# Altium project LM-004-B.PrjPcb
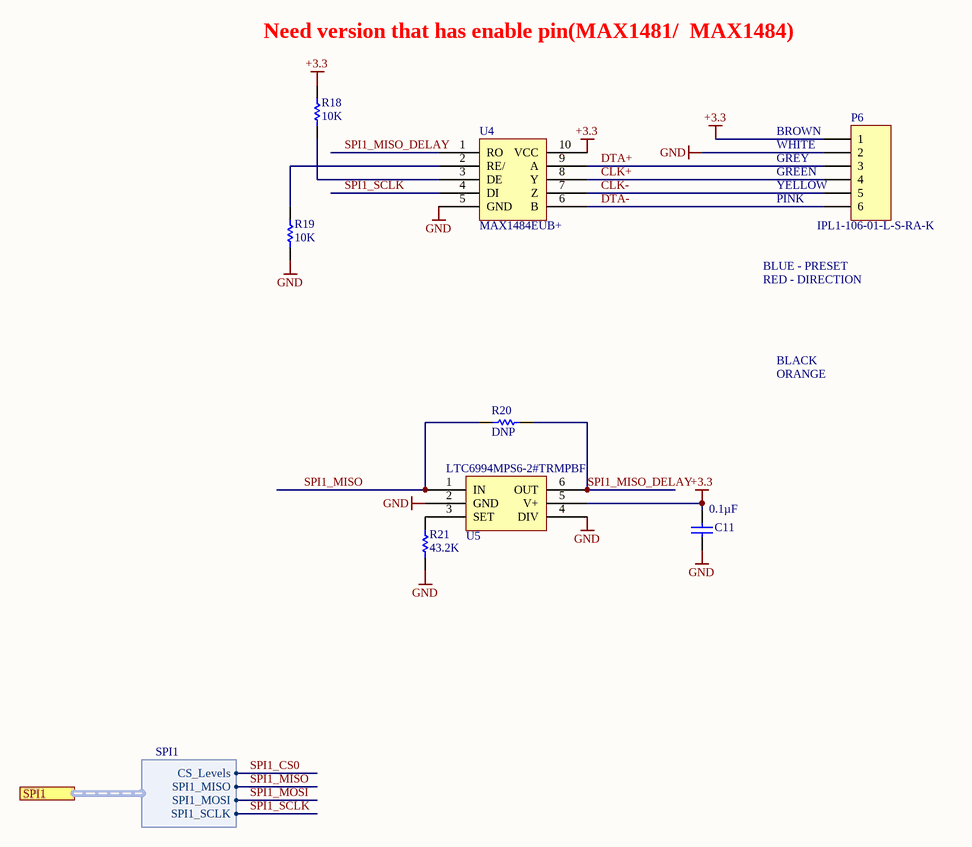
[diagram p0: Encoder.SchDoc]
1 sheet, 8 parts. Net scope: flat (ports and power ports of the same name join across sheets).
Board file: LM-004-B.PcbDoc

## Sheet Encoder.SchDoc: Encoder
size OrCAD A; DocumentNumber: LM-004; Revision: B; SheetNumber: 2; SheetTotal: 4

### Parts
C11  Capacitance: 0.1µF  [CAPC0805(2012)145_N]  (hidden comment: CAP CER 0.1UF 25V X7R 0805)
P6  IPL1-106-01-L-S-RA-K  [IPL1-106-01-L-S-RA-K]
R18  10K  [RESC0805(2012)_L]
R19  10K  [RESC0805(2012)_L]
R20  DNP  [RESC0805(2012)_L]
R21  43.2K  [RESC0805(2012)_L]
U4  MAX1484EUB+  [MAX1484EUB+]
U5  LTC6994MPS6-2#TRMPBF  [LTC6994MPS6-2#TRMPBF]

### Ports
SPI1 (harness SPI1)

### Harnesses
SPI1: CS_Levels, SPI1_MISO, SPI1_MOSI, SPI1_SCLK

### Nets
+3.3: C11.1 P6.1 R18.2 U4.10(VCC) U5.5(V+)
GND: C11.2 P6.2 R19.1 R21.2 U4.5(GND) U5.2(GND) U5.4(DIV)
CLK+: P6.4 U4.8(Y)
CLK-: P6.5 U4.7(Z)
DTA+: P6.3 U4.9(A)
DTA-: P6.6 U4.6(B)
SPI1_CS0: port SPI1.CS_Levels
SPI1_MISO: R20.1 U5.1(IN) ; port SPI1.SPI1_MISO
SPI1_MISO_DELAY: R20.2 U4.1(RO) U5.6(OUT)
SPI1_MOSI: port SPI1.SPI1_MOSI
SPI1_SCLK: U4.4(DI) ; port SPI1.SPI1_SCLK
NetR18_1: R18.1 U4.3(DE)
NetR19_2: R19.2 U4.2(RE/)
NetR21_1: R21.1 U5.3(SET)

### Notes on the sheet
- Need version that has enable pin(MAX1481/  MAX1484)
- (near P6) BROWN
- (near P6) WHITE
- (near P6) GREY
- (near P6) GREEN
- (near P6) YELLOW
- (near P6) PINK
- BLUE - PRESET
- RED - DIRECTION
- ORANGE
- BLACK
- Title
- Size:
- Date:
- Orcad A
- Number:
- Time:
- Revision:
- Sheet
- of
- ZLS Corporation
- 7801 North Lamar Blvd.
- Suite E-184
- Austin, Texas 78752  USA
- (512) 453-0288
- File:

### Library data of the parts
C11 = CMP-1036-04795-1: Manufacturer: Murata Electronics North America; Manufacturer Part Number: GRM21BR71E104KA01L; Tolerance: ±10%; Supplier 1: Digi-Key; Supplier Part Number 1: 490-1673-6-ND; RoHS: RoHS Compliant; Category: Capacitors; Stock 1: 891652; Pricing 1: 1=0.2, 10=0.145, 100=0.0683, 500=0.04788, 1000=0.03964 (USD); Packaging: Digi-Reel®; Part Status: Active; Voltage - Rated: 25V; Temperature Coefficient: X7R; Operating Temperature: -55°C ~ 125°C; Features: -; Ratings: -; Applications: General Purpose; Mounting Type: Surface Mount, MLCC; Package / Case: 0805 (2012 Metric); Size / Dimension: 0.079" L x 0.049" W (2.00mm x 1.25mm); Height - Seated (Max): -; Thickness (Max): 0.053" (1.35mm); Lead Spacing: -; Lead Style: -; ComponentLink1URL: http://www.murata.com/~/media/webrenewal/support/library/catalog/products/capacitor/mlcc/c02e.ashx; ComponentLink1Description: http://www.murata.com/~/media/webrenewal/support/library/catalog/products/capacitor/mlcc/c02e.ashx
P6 = Header 6: Header, 6-Pin; Manufacturer: Samtec Inc.; Pitch - Mating: 0.100" (2.54mm); Number of Positions: 6; Number of Positions Loaded: All; Style: Board to Cable/Wire; Shrouding: Shrouded - 4 Wall; Contact Length - Mating: 0.215" (5.46mm); Contact Length - Post: 0.085" (2.16mm); Material Flammability Rating: UL94 V-0; Voltage Rating: 675VAC, 954VDC; Supplier 1: Digi-Key; Supplier Part Number 1: SAM9602-ND; Manufacturer Part Number: IPL1-106-01-L-S-RA-K; RoHS: RoHS Compliant; Category: Connectors, Interconnects; Stock 1: 6; Pricing 1: 1=2.73, 34=2.39794, 102=2.18, 510=1.853, 1020=1.5805, 5032=1.417 (USD); Packaging: Tube; Part Status: Active; Connector Type: Header; Contact Type: Male Pin; Number of Rows: 1; Row Spacing - Mating: -; Mounting Type: Through Hole, Right Angle; Termination: Solder; Fastening Type: Locking Ramp; Overall Contact Length: -; Insulation Height: 0.240" (6.10mm); Contact Shape: Square; Contact Finish - Mating: Gold; Contact Finish Thickness - Mating: 10.0µin (0.25µm); Contact Finish - Post: Tin; Contact Material: Phosphor Bronze; Insulation Material: Liquid Crystal Polymer (LCP); Features: -; Operating Temperature: -55°C ~ 125°C; Ingress Protection: -; Insulation Color: Natural; Current Rating: -; Mated Stacking Heights: -; Contact Finish Thickness - Post: -; Applications: -; ComponentLink1URL: http://suddendocs.samtec.com/prints/ipl1-1xx-xx-xxx-s-xx-x-xx-mkt.pdf; ComponentLink1Description: http://suddendocs.samtec.com/prints/ipl1-1xx-xx-xxx-s-xx-x-xx-mkt.pdf
R18 R19 = CMP-1013-00215-1: RES SMD 10K OHM 1% 1/8W 0805; Manufacturer: Vishay Dale; Manufacturer Part Number: CRCW080510K0FKEA; Power (Watts): 0.125W, 1/8W; Temperature Coefficient: ±100ppm/°C; Supplier 1: Digi-Key; Supplier Part Number 1: 541-10.0KCCT-ND; RoHS: RoHS Compliant; Category: Resistors; Stock 1: 1104982; Pricing 1: 1=0.1, 10=0.055, 100=0.0223, 1000=0.01003, 2500=0.0087 (USD); Packaging: Cut Tape (CT); Part Status: Active; Tolerance: ±1%; Composition: Thick Film; Features: Automotive AEC-Q200; Operating Temperature: -55°C ~ 155°C; Package / Case: 0805 (2012 Metric); Supplier Device Package: 0805; Size / Dimension: 0.079" L x 0.049" W (2.00mm x 1.25mm); Height - Seated (Max): 0.020" (0.50mm); Failure Rate: -; ComponentLink1URL: http://www.vishay.com/docs/20035/dcrcwe3.pdf; ComponentLink1Description: http://www.vishay.com/docs/20035/dcrcwe3.pdf
R20 = CMP-1013-00215-1: RES SMD 0 OHM 5% 1/8W 0805
R21 = CMP-1013-00215-1: RES SMD 43.2K OHM 1% 1/8W 0805; Manufacturer: Vishay Dale; Manufacturer Part Number: CRCW080543K2FKEA; Power (Watts): 0.125W, 1/8W; Temperature Coefficient: ±100ppm/°C; Supplier 1: Digi-Key; Supplier Part Number 1: 541-43.2KCCT-ND; RoHS: RoHS Compliant; Category: Resistors; Stock 1: 68577; Pricing 1: 1=0.1, 10=0.055, 100=0.0223, 1000=0.01003, 2500=0.0087 (USD); Packaging: Cut Tape (CT); Part Status: Active; Tolerance: ±1%; Composition: Thick Film; Features: Automotive AEC-Q200; Operating Temperature: -55°C ~ 155°C; Package / Case: 0805 (2012 Metric); Supplier Device Package: 0805; Size / Dimension: 0.079" L x 0.049" W (2.00mm x 1.25mm); Height - Seated (Max): 0.020" (0.50mm); Failure Rate: -; ComponentLink1URL: http://www.vishay.com/docs/20035/dcrcwe3.pdf; ComponentLink1Description: http://www.vishay.com/docs/20035/dcrcwe3.pdf
U4 = MAX1484EUB+: IC TXRX RS485/RS422 10-UMAX; Manufacturer: Maxim Integrated; Protocol: RS422, RS485; Number of Drivers/Receivers: 1/1; Duplex: Full; Data Rate: 12Mbps; Voltage - Supply: 4.75 V ~ 5.25 V; Supplier 1: Digi-Key; Supplier Part Number 1: MAX1484EUB+-ND; Manufacturer Part Number: MAX1484EUB+; RoHS: RoHS Compliant; Category: Integrated Circuits (ICs); Stock 1: 1906; Pricing 1: 1=2.57, 10=2.442, 25=2.28, 50=2.28 (USD); Packaging: Tube; Part Status: Active; Type: Transceiver; Operating Temperature: -40°C ~ 85°C; Mounting Type: Surface Mount; Package / Case: 10-TFSOP, 10-MSOP (0.118", 3.00mm Width); Supplier Device Package: 10-uMAX; Base Part Number: MAX1484; ComponentLink1URL: https://datasheets.maximintegrated.com/en/ds/MAX1481-MAX1486.pdf; ComponentLink1Description: https://datasheets.maximintegrated.com/en/ds/MAX1481-MAX1486.pdf
U5 = LTC6994MPS6-2#TRMPBF: Manufacturer: Linear Technology/Analog Devices; Manufacturer Part Number: LTC6994CS6-2#TRMPBF; Function: Programmable; Available Total Delays: 1µs ~ 33.6s; Voltage - Supply: 2.25 V ~ 5.5 V; Supplier 1: Digi-Key; Supplier Part Number 1: LTC6994CS6-2#TRMPBFCT-ND; RoHS: RoHS Compliant; Category: Integrated Circuits (ICs); Stock 1: 1401; Pricing 1: 1=3.42, 25=3.0496, 100=1.9217, 250=1.76156 (USD); Packaging: Cut Tape (CT); Part Status: Active; Delay to 1st Tap: -; Operating Temperature: 0°C ~ 70°C; Mounting Type: Surface Mount; Package / Case: SOT-23-6 Thin, TSOT-23-6; Supplier Device Package: TSOT-23-6; Base Part Number: LTC6994; ComponentLink1URL: http://www.linear.com/docs/29725; ComponentLink1Description: http://www.linear.com/docs/29725